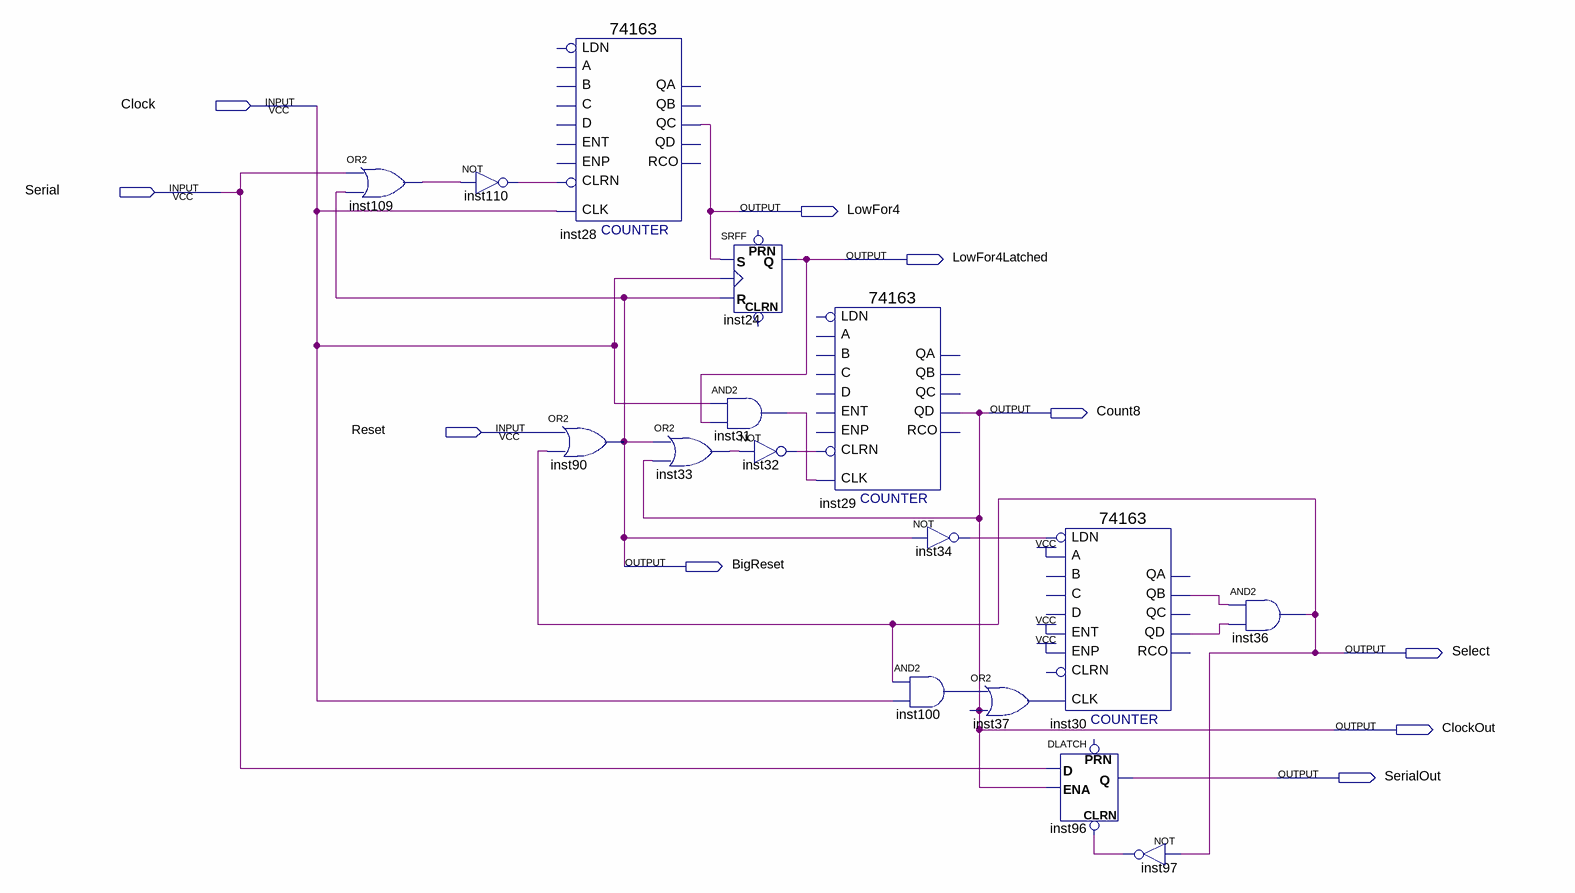
[diagram p0: schematic sheet]
// Quartus schematic ControlSystem.bdf as structural Verilog: 16 symbols, 10 pins
module ControlSystem (
  input  Clock,
  input  Serial,
  input  Reset,
  output LowFor4,
  output LowFor4Latched,
  output Count8,
  output BigReset,
  output Select,
  output ClockOut,
  output SerialOut
);

  wire inst30_qb, inst30_qd, inst31_out, inst32_out, inst33_out, inst34_out, inst37_out, inst97_out,
       inst100_out, inst109_out, inst110_out;

  or inst109 (inst109_out, Serial, BigReset);
  not inst110 (inst110_out, inst109_out);
  \74163  inst28 (.CLRN(inst110_out), .CLK(Clock), .QC(LowFor4));  // open: C, B, A, ENT, D, ENP, LDN, QA, QB, QD, RCO
  or inst90 (BigReset, Reset, Select);
  SRFF inst24 (.S(LowFor4), .R(BigReset), .CLK(Clock), .Q(LowFor4Latched));  // open: PRN, CLRN
  and inst31 (inst31_out, Clock, LowFor4Latched);
  or inst33 (inst33_out, BigReset, ClockOut);
  not inst32 (inst32_out, inst33_out);
  \74163  inst29 (
    .CLRN(inst32_out), .CLK(inst31_out), .QD(ClockOut));  // open: C, B, A, ENT, D, ENP, LDN, QA, QB, QC, RCO
  not inst34 (inst34_out, BigReset);
  and inst100 (inst100_out, Select, Clock);
  or inst37 (inst37_out, inst100_out, ClockOut);
  \74163  inst30 (
    .A(1'b1), .ENT(1'b1), .CLK(inst37_out), .ENP(1'b1), .LDN(inst34_out), .QB(inst30_qb), .QD(inst30_qd));  // open: C, B, D, CLRN, QA, QC, RCO
  DLATCH inst96 (.CLRN(inst97_out), .D(Serial), .ENA(ClockOut), .Q(SerialOut));  // open: PRN
  not inst97 (inst97_out, Select);
  and inst36 (Select, inst30_qb, inst30_qd);

  assign Count8 = ClockOut;
endmodule
